# EAGLE design LEDStatusBoard (EAGLE 9.6.2)
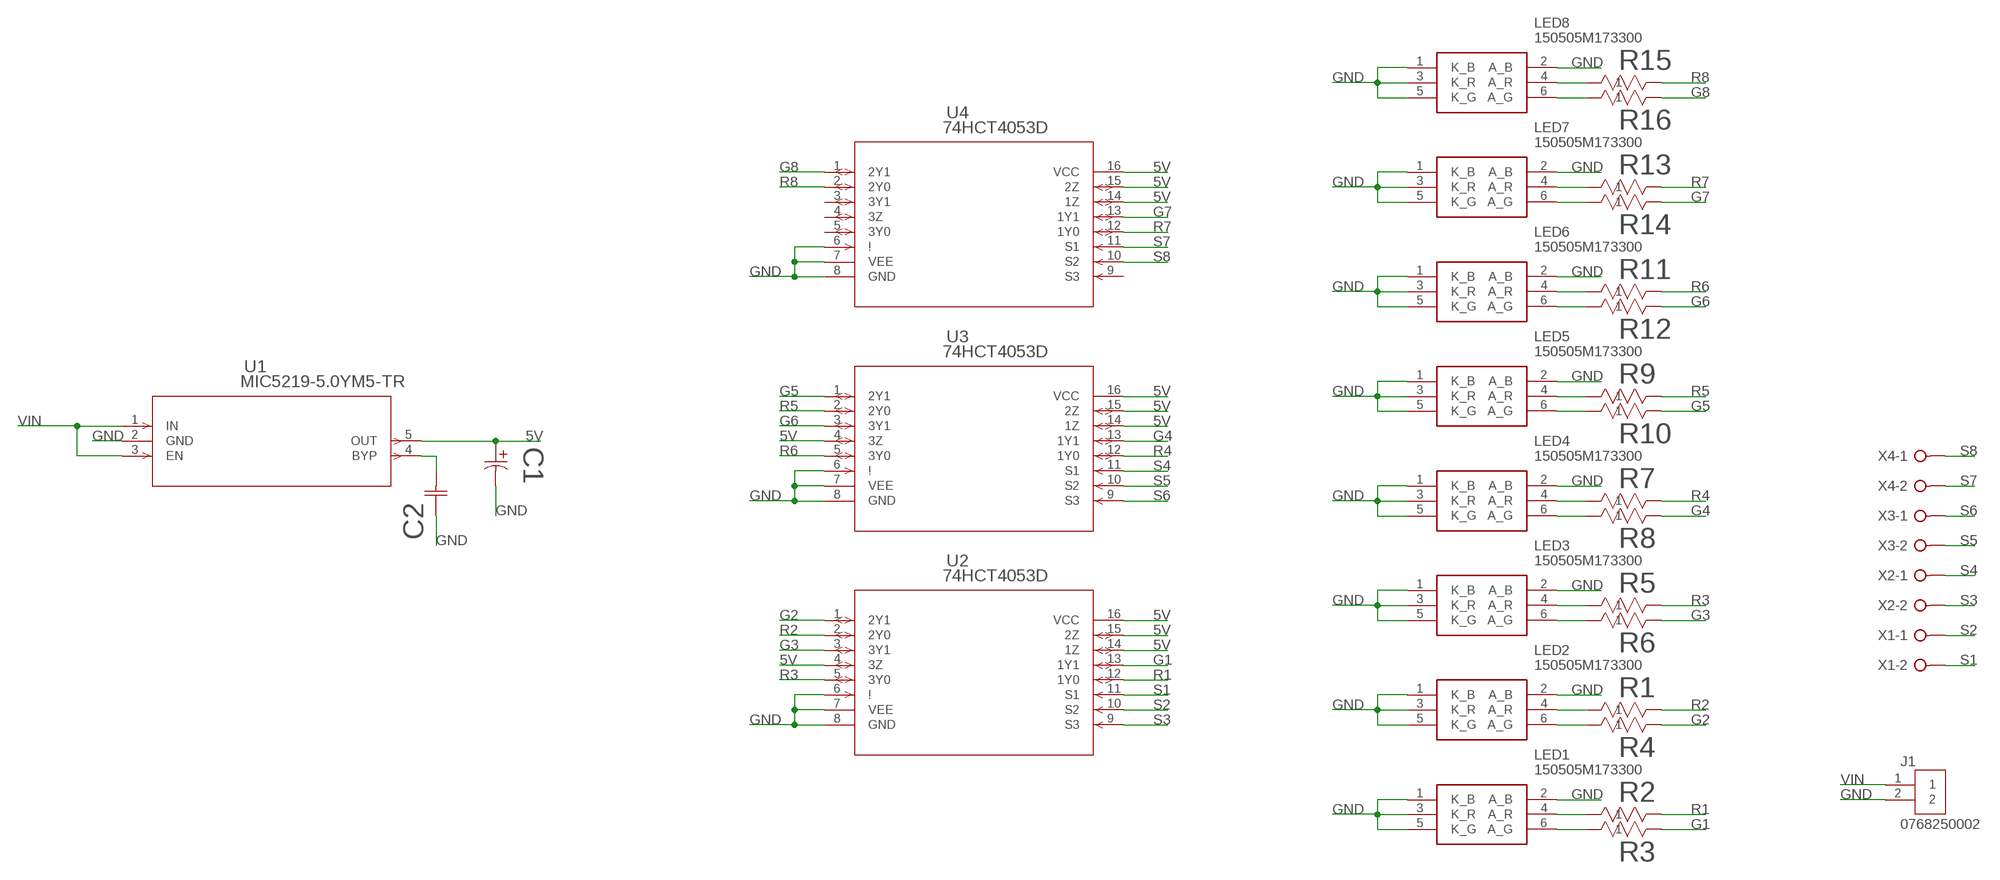
[diagram p0: schematic, sheet 1]

## Parts
C1  UWX1H2R2MCL1GB  [PCAP_4X5.4-ELECT_NCA]
C2  1206AA471JAT1A  [CAP_1206_AVX]
J1  0768250002  [MOLEX_0768250002]
LED1  150505M173300  [150505M173300]
LED2  150505M173300  [150505M173300]
LED3  150505M173300  [150505M173300]
LED4  150505M173300  [150505M173300]
LED5  150505M173300  [150505M173300]
LED6  150505M173300  [150505M173300]
LED7  150505M173300  [150505M173300]
LED8  150505M173300  [150505M173300]
R1  RMCF1206JT130R  [RES_RMCF1206_STP]
R2  RMCF1206JT130R  [RES_RMCF1206_STP]
R3  RMCF1206JT130R  [RES_RMCF1206_STP]
R4  RMCF1206JT130R  [RES_RMCF1206_STP]
R5  RMCF1206JT130R  [RES_RMCF1206_STP]
R6  RMCF1206JT130R  [RES_RMCF1206_STP]
R7  RMCF1206JT130R  [RES_RMCF1206_STP]
R8  RMCF1206JT130R  [RES_RMCF1206_STP]
R9  RMCF1206JT130R  [RES_RMCF1206_STP]
R10  RMCF1206JT130R  [RES_RMCF1206_STP]
R11  RMCF1206JT130R  [RES_RMCF1206_STP]
R12  RMCF1206JT130R  [RES_RMCF1206_STP]
R13  RMCF1206JT130R  [RES_RMCF1206_STP]
R14  RMCF1206JT130R  [RES_RMCF1206_STP]
R15  RMCF1206JT130R  [RES_RMCF1206_STP]
R16  RMCF1206JT130R  [RES_RMCF1206_STP]
U1  MIC5219-5.0YM5-TR  [SOT-23-5_M5_MCH]
U2  74HCT4053D  [SOT109-1_NXP]
U3  74HCT4053D  [SOT109-1_NXP]
U4  74HCT4053D  [SOT109-1_NXP]
X1  W237-02P  [W237-132]
X2  W237-02P  [W237-132]
X3  W237-02P  [W237-132]
X4  W237-02P  [W237-132]

## Nets
5V: C1.1 U1.5(OUT) U2.4(3Z) U2.14(1Z) U2.15(2Z) U2.16(VCC) U3.4(3Z) U3.14(1Z) U3.15(2Z) U3.16(VCC) U4.14(1Z) U4.15(2Z) U4.16(VCC)
G1: R3.2 U2.13(1Y1)
G2: R4.2 U2.1(2Y1)
G3: R6.2 U2.3(3Y1)
G4: R8.2 U3.13(1Y1)
G5: R10.2 U3.1(2Y1)
G6: R12.2 U3.3(3Y1)
G7: R14.2 U4.13(1Y1)
G8: R16.2 U4.1(2Y1)
GND: C1.2 C2.1 J1.2 LED1.1(K_B) LED1.2(A_B) LED1.3(K_R) LED1.5(K_G) LED2.1(K_B) LED2.2(A_B) LED2.3(K_R) LED2.5(K_G) LED3.1(K_B) LED3.2(A_B) LED3.3(K_R) LED3.5(K_G) LED4.1(K_B) LED4.2(A_B) LED4.3(K_R) LED4.5(K_G) LED5.1(K_B) LED5.2(A_B) LED5.3(K_R) LED5.5(K_G) LED6.1(K_B) LED6.2(A_B) LED6.3(K_R) LED6.5(K_G) LED7.1(K_B) LED7.2(A_B) LED7.3(K_R) LED7.5(K_G) LED8.1(K_B) LED8.2(A_B) LED8.3(K_R) LED8.5(K_G) U1.2(GND) U2.6(!) U2.7(VEE) U2.8(GND) U3.6(!) U3.7(VEE) U3.8(GND) U4.6(!) U4.7(VEE) U4.8(GND)
N$1: C2.2 U1.4(BYP)
N$3: LED1.4(A_R) R2.1
N$4: LED1.6(A_G) R3.1
N$6: LED2.4(A_R) R1.1
N$7: LED2.6(A_G) R4.1
N$8: LED3.4(A_R) R5.1
N$10: LED3.6(A_G) R6.1
N$13: LED4.4(A_R) R7.1
N$14: LED4.6(A_G) R8.1
N$17: LED5.4(A_R) R9.1
N$18: LED5.6(A_G) R10.1
N$21: LED6.4(A_R) R11.1
N$22: LED6.6(A_G) R12.1
N$25: LED7.4(A_R) R13.1
N$26: LED7.6(A_G) R14.1
N$29: LED8.4(A_R) R15.1
N$30: LED8.6(A_G) R16.1
R1: R2.2 U2.12(1Y0)
R2: R1.2 U2.2(2Y0)
R3: R5.2 U2.5(3Y0)
R4: R7.2 U3.12(1Y0)
R5: R9.2 U3.2(2Y0)
R6: R11.2 U3.5(3Y0)
R7: R13.2 U4.12(1Y0)
R8: R15.2 U4.2(2Y0)
S1: U2.11(S1) X1.2
S2: U2.10(S2) X1.1
S3: U2.9(S3) X2.2
S4: U3.11(S1) X2.1
S5: U3.10(S2) X3.2
S6: U3.9(S3) X3.1
S7: U4.11(S1) X4.2
S8: U4.10(S2) X4.1
VIN: J1.1 U1.1(IN) U1.3(EN)
Unconnected: U4.3(3Y1) U4.4(3Z) U4.5(3Y0) U4.9(S3)

## Library data of the parts
C1 = UWX1H2R2MCL1GB:UWX1H2R2MCL1GB; BUILT_BY: EMA_UL_Team; MANUFACTURER_PART_NUMBER: UWX1H2R2MCL1GB; SOURCELIBRARY: Nichicon_2011-10-21; VENDOR: Nichicon
C2 = 1206AA471JAT1A:1206AA471JAT1A; BUILT_BY: EMA_UL_Team; COPYRIGHT: Copyright (C) 2018 Accelerated Designs. All rights reserved; MANUFACTURER_PART_NUMBER: 1206AA471JAT1A; SOURCELIBRARY: AVX_2015_05_20; VENDOR: AVX Corporation
J1 = 0768250002:0768250002: DUAL ROW RA HEADER TIN 2CKT; AVAILABILITY: Unavailable; DESCRIPTION: DUAL ROW RA HEADER TIN 2CKT; MF: Molex; MP: 0768250002; PACKAGE: None; PRICE: None
LED1-LED8 = SamacSys_Parts:150505M173300: 2.4 V RGB LED 5050 SMD, Wurth Elektronik WL-SFTW 150505M173300 Source: Datasheet <https://katalog.we-online.de/led/datasheet/150505M173300.pdf>; DESCRIPTION: 2.4 V RGB LED 5050 SMD, Wurth Elektronik WL-SFTW 150505M173300; HEIGHT: 1.8mm; MANUFACTURER_NAME: Wurth Elektronik; MANUFACTURER_PART_NUMBER: 150505M173300; MOUSER_PART_NUMBER: 710-150505M173300; MOUSER_PRICE-STOCK: https://www.mouser.co.uk/ProductDetail/Wurth-Elektronik/150505M173300?qs=fAHHVMwC%252Bbi%2FURn4Qu0%2FAA%3D%3D
R1-R16 = RMCF1206JT130R:RMCF1206JT130R; BUILT_BY: EMA_Cory; COPYRIGHT: Copyright (C) 2018 Accelerated Designs. All rights reserved; MANUFACTURER_PART_NUMBER: RMCF1206JT130R; SOURCELIBRARY: Stackpole_Electronics_2019-07-10_1; VENDOR: Stackpole
U1 = MIC5219-5.0YM5-TR:MIC5219-5.0YM5-TR; BUILT_BY: EMA_Jessica; COPYRIGHT: Copyright (C) 2018 Accelerated Designs. All rights reserved; MANUFACTURER_PART_NUMBER: MIC5219-5.0YM5-TR; SOURCELIBRARY: Microchip_2019-08-23_3; VENDOR: Microchip
U2-U4 = 74HCT4053D:74HCT4053D; BUILT_BY: EMA_UL_Team; MANUFACTURER_PART_NUMBER: 74HCT4053D; SOURCELIBRARY: NXP_2011-11-10; VENDOR: NXP
X1-X4 = con-wago-508:W237-02P: WAGO SREW CLAMP; OC_FARNELL: unknown; OC_NEWARK: unknown

## Board
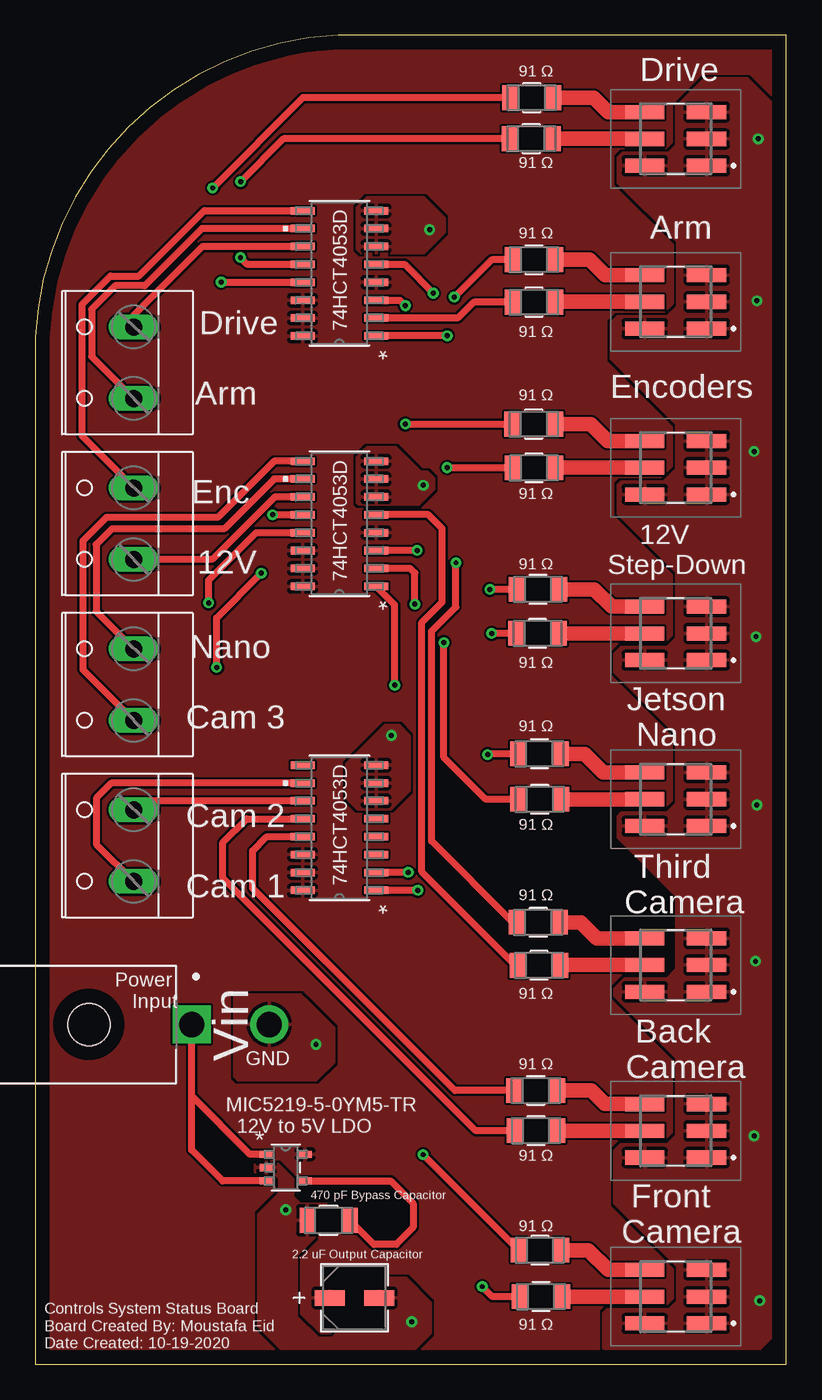
[diagram p1: board, top side]
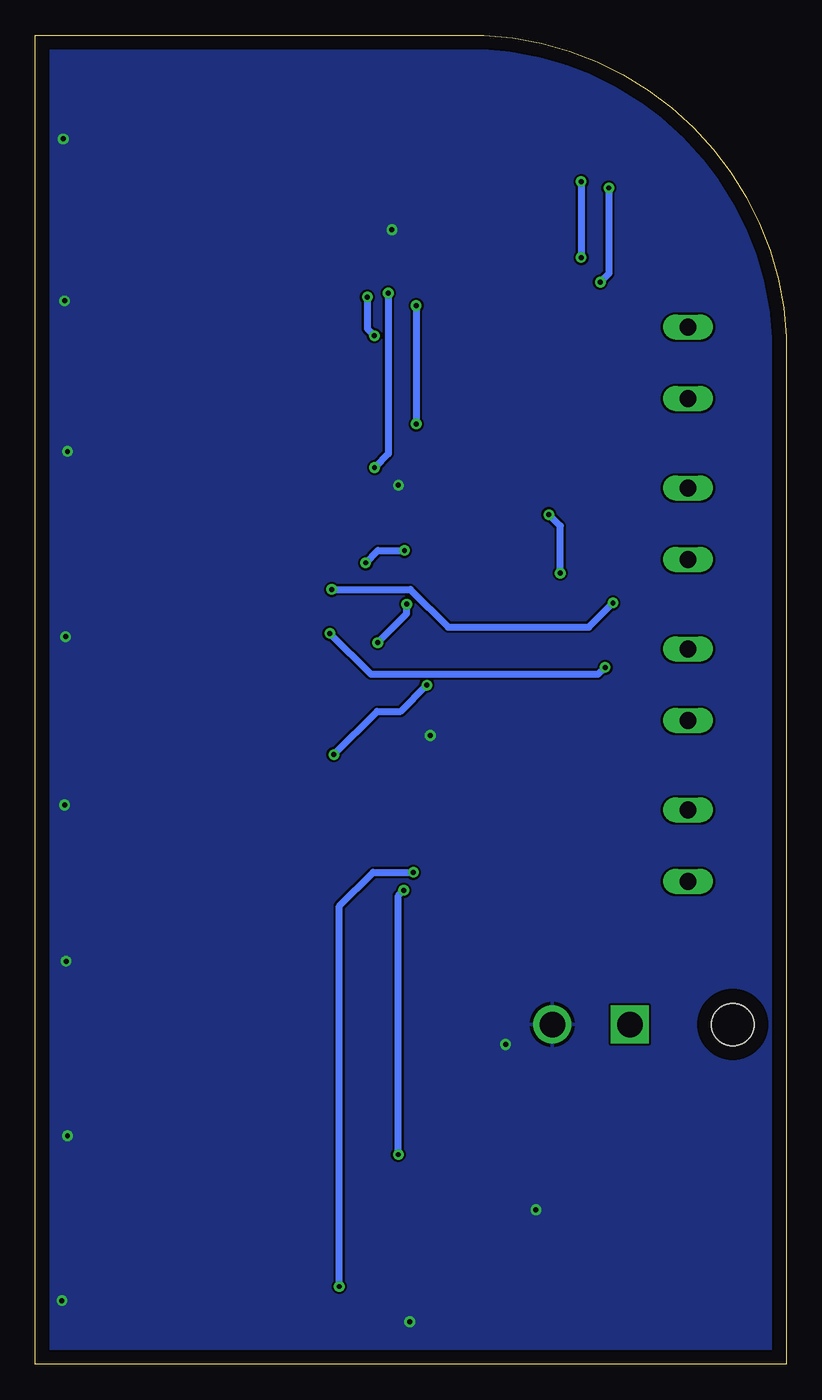
[diagram p2: board, bottom side, seen from below]

Size 53.32 x 94.38 mm. Coordinates in mm from the lower left corner, seen from the top.
Outline: 0,70.88 0,0 53.32,0 53.32,94.38 21.5,94.38 arc90 0,70.88
Copper layers (1*16): Top 0.035mm / dielectric 1.5mm / Bottom 0.035mm
Design rules "default": minimum track width 6mil, minimum drill 0.35mm, track to track 6mil, track to pad 6mil, pad to pad 6mil, via to via 6mil, smd to smd 6mil, copper to edge 40mil, drill to drill 6mil, minimum pad ring 10mil, minimum via ring 8mil, stop-mask expansion 4mil, vias tented up to drill 0mil, thermal gap 10mil

### Footprints (pad centres in the part's own frame; a part is rotated, then mirrored left to right if it is on the bottom)
PCAP_4X5.4-ELECT_NCA = smd 2.108 x 1.092: 1 -1.753,0; 2 1.753,0
CAP_1206_AVX = smd 1.106 x 1.8: 1 -1.503,0; 2 1.503,0
MOLEX_0768250002 = drill 1.8 square: 1 0,7.3 | drill 1.8: 2 0,12.8 | hole 3: 0,0
150505M173300 = smd 2.8 x 1: 1 -2.2,1.9; 2 2.2,1.9; 3 -2.2,0; 4 2.2,0; 5 -2.2,-1.9; 6 2.2,-1.9
RES_RMCF1206_STP = smd 1.168 x 1.753: 1 -1.499,0; 2 1.499,0
SOT-23-5_M5_MCH = smd 0.978 x 0.508: 1 -1.365,0.95; 2 -1.365,0; 3 -1.365,-0.95; 4 1.365,-0.95; 5 1.365,0.95
SOT109-1_NXP = smd 1.702 x 0.533: 1 -2.603,4.445; 2 -2.603,3.175; 3 -2.603,1.905; 4 -2.603,0.635; 5 -2.603,-0.635; 6 -2.603,-1.905; 7 -2.603,-3.175; 8 -2.603,-4.445; 9 2.603,-4.445; 10 2.603,-3.175; 11 2.603,-1.905; 12 2.603,-0.635; 13 2.603,0.635; 14 2.603,1.905; 15 2.603,3.175; 16 2.603,4.445
W237-132 = drill 1.194 long: 1 -2.54,-0.635; 2 2.54,-0.635

### Placement (x,y rotation side)
C1  22.66,4.72 0 top
C2  20.83,10.22 0 top
J1  3.81,24.13 270 top
LED1  45.47,87.02 180 top
LED2  45.47,75.45 180 top
LED3  45.47,63.67 180 top
LED4  45.47,51.9 180 top
LED5  45.47,40.12 180 top
LED6  45.47,28.35 180 top
LED7  45.47,16.58 180 top
LED8  45.47,4.8 180 top
R1  35.4,75.42 180 top
R2  35.22,87.03 180 top
R3  35.25,89.94 180 top
R4  35.4,78.44 180 top
R5  35.41,63.65 180 top
R6  35.39,66.76 180 top
R7  35.66,51.9 180 top
R8  35.69,55.03 180 top
R9  35.81,40.12 180 top
R10  35.79,43.35 180 top
R11  35.77,28.33 180 top
R12  35.71,31.39 180 top
R13  35.55,16.59 180 top
R14  35.53,19.45 180 top
R15  35.9,4.81 180 top
R16  35.82,8.11 180 top
U1  17.78,13.97 0 top
U2  21.59,77.47 180 top
U3  21.59,59.69 180 top
U4  21.59,38.1 180 top
X1  6.35,71.12 90 top
X2  6.35,59.69 90 top
X3  6.35,48.26 90 top
X4  6.35,36.83 90 top

### Tracks (layer width: path | path; a pad name or v marks a point on that pad's centre or on a via)
5V
  pour Top (rank 2): -10.47,79.02 7.33,96.82 57.73,96.82 57.73,-3.08 -10.47,-3.08
G1  (via drill 0.35)
  Top 0.508: v12.59,83.53 19,89.94 R3.2 | v13.2,76.84 18.98,76.84 U2.13
  Bottom 0.508: v12.59,83.53 12.59,77.45 v13.2,76.84
G2  (via drill 0.35)
  Top 0.508: R4.2 32.39,78.44 v29.74,75.79 | v29.24,73.04 24.21,73.04 U2.1
  Bottom 0.508: v29.74,75.79 29.74,73.54 v29.24,73.04
G3  (via drill 0.35)
  Top 0.508: U2.3 25.89,75.56 v26.28,75.18 | v26.27,66.78 33.88,66.78 R6.2
  Bottom 0.508: v26.28,75.18 v26.28,66.78 v26.27,66.78
G4  (via drill 0.35)
  Top 0.508: R8.2 v32.28,55.03 v32.27,55.03 | v12.31,54.07 12.31,55.68 15.68,59.06 U3.13
  Bottom 0.508: v32.27,55.03 26.69,55.03 24.02,52.35 14.02,52.35 v12.31,54.07
G5  (via drill 0.35)
  Top 0.508: R10.2 34.28,43.34 32.16,43.34 v32.11,43.3 | v25.52,48.23 25.52,53.92 U3.1
  Bottom 0.508: v25.52,48.23 27.37,46.37 29.04,46.37 v32.11,43.3
G6  (via drill 0.35)
  Top 0.508: R12.2 33.91,31.39 28.15,37.15 28.15,52.05 29.86,53.77 v29.86,56.9 v29.87,56.91 | v27.11,57.79 24.2,57.79 U3.3
  Bottom 0.508: v29.87,56.91 28.99,57.79 v27.11,57.79
G7
  Top 0.508: R14.2 29.79,19.45 15.44,33.8 15.44,36.45 16.45,37.47 U4.13
G8  (via drill 0.35)
  Top 0.508: R16.2 v27.54,14.89 | v27.16,33.66 U4.1
  Bottom 0.508: v27.54,14.89 27.54,33.28 v27.16,33.66
GND  (via drill 0.35)
  other vias: 28,80.57 27.54,62.42 25.28,44.65 19.93,22.72 17.78,10.97 51.17,51.67 51.03,64.82 51.23,75.52 51.33,87.02 51.23,39.72 51.13,28.62 51.03,16.22 51.43,4.52 26.73,3.02
  pour Bottom: 11.03,94.92 55.63,94.92 55.63,-1.08 -7.47,-1.08 -7.47,76.42
  pour Top: 27.58,82.92 29.08,81.42 29.08,80.37 27.58,78.87 23.13,78.87 22.83,79.17 22.83,82.17 23.58,82.92
  pour Top: 27.33,63.42 27.83,63.42 28.33,62.92 28.33,62.12 27.23,61.02 22.98,61.02 22.83,61.17 22.83,64.42 23.58,65.17 25.58,65.17
  pour Top: 22.08,42.67 24.83,45.42 25.83,45.42 26.58,44.67 26.58,40.72 25.23,39.37 22.88,39.37 22.08,40.17
  pour Top: 44.98,3.92 40.58,3.92 40.28,3.62 40.28,1.17 40.68,0.77 51.18,0.77 52.43,2.02 52.43,89.47 50.58,91.32 47.48,91.32 45.48,89.32 45.48,86.57 44.93,86.02 41.68,86.02 41.33,85.67 41.33,83.92 45.53,79.72 45.53,75.12 44.83,74.42 41.33,74.42 40.83,73.92 40.83,71.42 45.48,66.77 45.48,63.57 44.58,62.67 41.58,62.67 41.33,62.42 41.33,60.42 45.48,56.27 45.48,51.57 44.83,50.92 41.58,50.92 41.08,50.42 41.08,49.17 45.48,44.77 45.48,39.82 44.83,39.17 41.58,39.17 41.33,38.92 41.33,37.42 45.48,33.27 45.48,28.07 44.83,27.42 41.83,27.42 41.08,26.67 41.08,26.17 45.48,21.77 45.48,16.27 44.83,15.62 41.53,15.62 41.08,15.17 41.08,11.42 45.53,6.97 45.53,4.47
  pour Top: 15.83,14.42 17.08,14.42 18.33,13.17 18.33,11.92 18.83,11.42 20.58,11.42 20.83,11.17 20.83,9.97 18.58,7.72 18.58,3.42 20.08,1.92 21.08,1.92 22.58,3.42 22.58,5.67 23.08,6.17 26.33,6.17 28.08,4.42 28.08,2.17 26.83,0.92 17.58,0.92 15.83,2.67 15.83,10.67 17.33,12.17 17.33,13.17 16.98,13.52 15.73,13.52 15.58,13.67 15.58,14.17
  pour Top: 15.13,26.32 18.83,26.32 19.43,25.72 21.23,23.92 21.23,21.42 19.93,20.12 14.43,20.12 14.13,20.42 14.13,26.22 14.23,26.32
N$1
  Top 0.508: U1.4 25.23,13.02 26.83,11.42 26.83,9.72 25.63,8.52 24.03,8.52 C2.2
N$3
  Top 1.016: LED1.4 36.73,87.02 R2.1
N$4
  Top 1.016: LED1.6 40.69,88.92 39.66,89.94 R3.1
N$6
  Top 1.016: LED2.4 36.93,75.45 R1.1
N$7
  Top 1.016: LED2.6 40.47,77.34 39.37,78.44 R4.1
N$8
  Top 1.016: LED3.4 36.92,63.67 R5.1
N$10
  Top 1.016: LED3.6 40.63,65.57 39.44,66.76 R6.1
N$13
  Top 1.016: LED4.4 R7.1
N$14
  Top 1.016: LED4.6 40.91,53.8 39.67,55.03 R8.1
N$17
  Top 1.016: LED5.4 R9.1
N$18
  Top 1.016: LED5.6 40.34,42.02 39.01,43.35 R10.1
N$21
  Top 1.016: LED6.4 37.28,28.35 R11.1
N$22
  Top 1.016: LED6.6 39.87,30.25 38.73,31.39 R12.1
N$25
  Top 1.016: LED7.4 37.06,16.58 R13.1
N$26
  Top 1.016: LED7.6 40.44,18.48 39.47,19.45 R14.1
N$29
  Top 1.016: LED8.4 R15.1
N$30
  Top 1.016: LED8.6 40.67,6.7 39.27,8.11 R16.1
R1  (via drill 0.35)
  Top 0.508: R2.2 17.61,87.03 v14.58,83.99 | v14.57,78.59 14.99,78.17 15.06,78.11 U2.12
  Bottom 0.508: v14.58,83.99 v14.58,78.59 v14.57,78.59
R2
  Top 0.508: R1.2 31.12,75.42 29.99,74.3 U2.2
R3  (via drill 0.35)
  Top 0.508: U2.5 26.22,78.11 v28.25,76.07 | v29.23,63.68 33.89,63.68 R5.2
  Bottom 0.508: v28.25,76.07 28.25,64.66 v29.23,63.68
R4  (via drill 0.35)
  Top 0.508: R7.2 v32.4,51.9 | v12.87,49.49 12.87,53 v16.05,56.17 | v16.85,60.33 18.98,60.33 U3.12
  Bottom 0.508: v32.4,51.9 29.5,49 13.36,49 v12.87,49.49 | v16.05,56.17 16.05,59.53 v16.85,60.33
R5  (via drill 0.35)
  Top 0.508: R9.2 31.99,40.12 29.01,43.11 v29.01,51.24 | v26.95,53.98 26.95,56.19 26.62,56.52 U3.2
  Bottom 0.508: v29.01,51.24 26.95,53.3 v26.95,53.98
R6
  Top 0.508: R11.2 34.08,28.33 27.44,34.97 27.44,52.68 28.88,54.12 28.88,59.35 27.9,60.33 U3.5
R7
  Top 0.508: R13.2 31.27,16.59 13.33,34.54 13.33,37.06 15,38.73 U4.12
R8  (via drill 0.35)
  Top 0.508: R15.2 32.44,4.81 v31.73,5.52 | v26.48,34.94 24.21,34.94 U4.2
  Bottom 0.508: v31.73,5.52 31.73,32.55 29.34,34.94 v26.48,34.94
S1
  Top 0.508: U2.11 11.87,79.38 6.99,74.49 X1.2
S2
  Top 0.508: U2.10 11.83,80.64 7.77,76.59 5.67,76.59 4,74.92 4,71.56 X1.1
S3
  Top 0.305: 6.98,62.27 X2.2 | U2.9
  Top 0.508: 6.98,62.27 3.31,65.94 3.31,75.25 5.34,77.28 7.36,77.28 12,81.92 U2.9
S4
  Top 0.508: U3.11 17,61.59 12.56,57.15 X2.1
S5
  Top 0.508: U3.10 16.96,62.86 13.41,59.32 5.44,59.32 4.33,58.21 4.33,53.45 X3.2
S6
  Top 0.508: U3.9 16.96,64.14 12.95,60.13 5.04,60.13 3.38,58.46 3.38,49.33 X3.1
S7
  Top 0.508: U4.11 7.62,40.01 X4.2
S8
  Top 0.508: U4.10 5.41,41.27 4.34,40.21 4.34,36.93 X4.1
VIN
  Top 0.508: U1.1 15.24,14.92 11.11,19.05 | 11.11,19.05 J1.1 | U1.3 13.3,13.02 11.11,15.21 11.11,19.05

### Text on the board
tNames: 91 Ω | Drive | 91 Ω | 74HCT4053D | 91 Ω | Arm | Drive | 91 Ω | Arm | 91 Ω | Encoders | 74HCT4053D | Enc | 91 Ω | 12V | 91 Ω | 12V / Step-Down | Nano | 91 Ω | Cam 3 | 91 Ω | Jetson / Nano | 74HCT4053D | Cam 2 | 91 Ω | Cam 1 | 91 Ω | Third / Camera | Power / Input | 91 Ω | Vin | GND | 91 Ω | Back / Camera | MIC5219-5-0YM5-TR / 12V to 5V LDO | 91 Ω | 470 pF Bypass Capacitor | 91 Ω | Front / Camera | 2.2 uF Output Capacitor | 91 Ω | Controls System Status Board / Board Created By: Moustafa Eid / Date Created: 10-19-2020